# EasyEDA Pro project ProPrj_PASSMAN BLE Fingerprint V1_2025-09-09.epro

# Schematic BLE Fingerprint PM

## Sheets
1 ESP32 Mini: Board Name: Board1; Create Date: 2025-07-29; Page Name: ESP32 Mini; Project Name: PASSMAN BLE Fingerprint V1; Schematic Name: BLE Fingerprint PM; Update Date: 2025-08-02; Company: EasyEDA.com; Drawn: Luca Pazzini; Page Size: A4; Reviewed: Tolentino; Version: V1.0
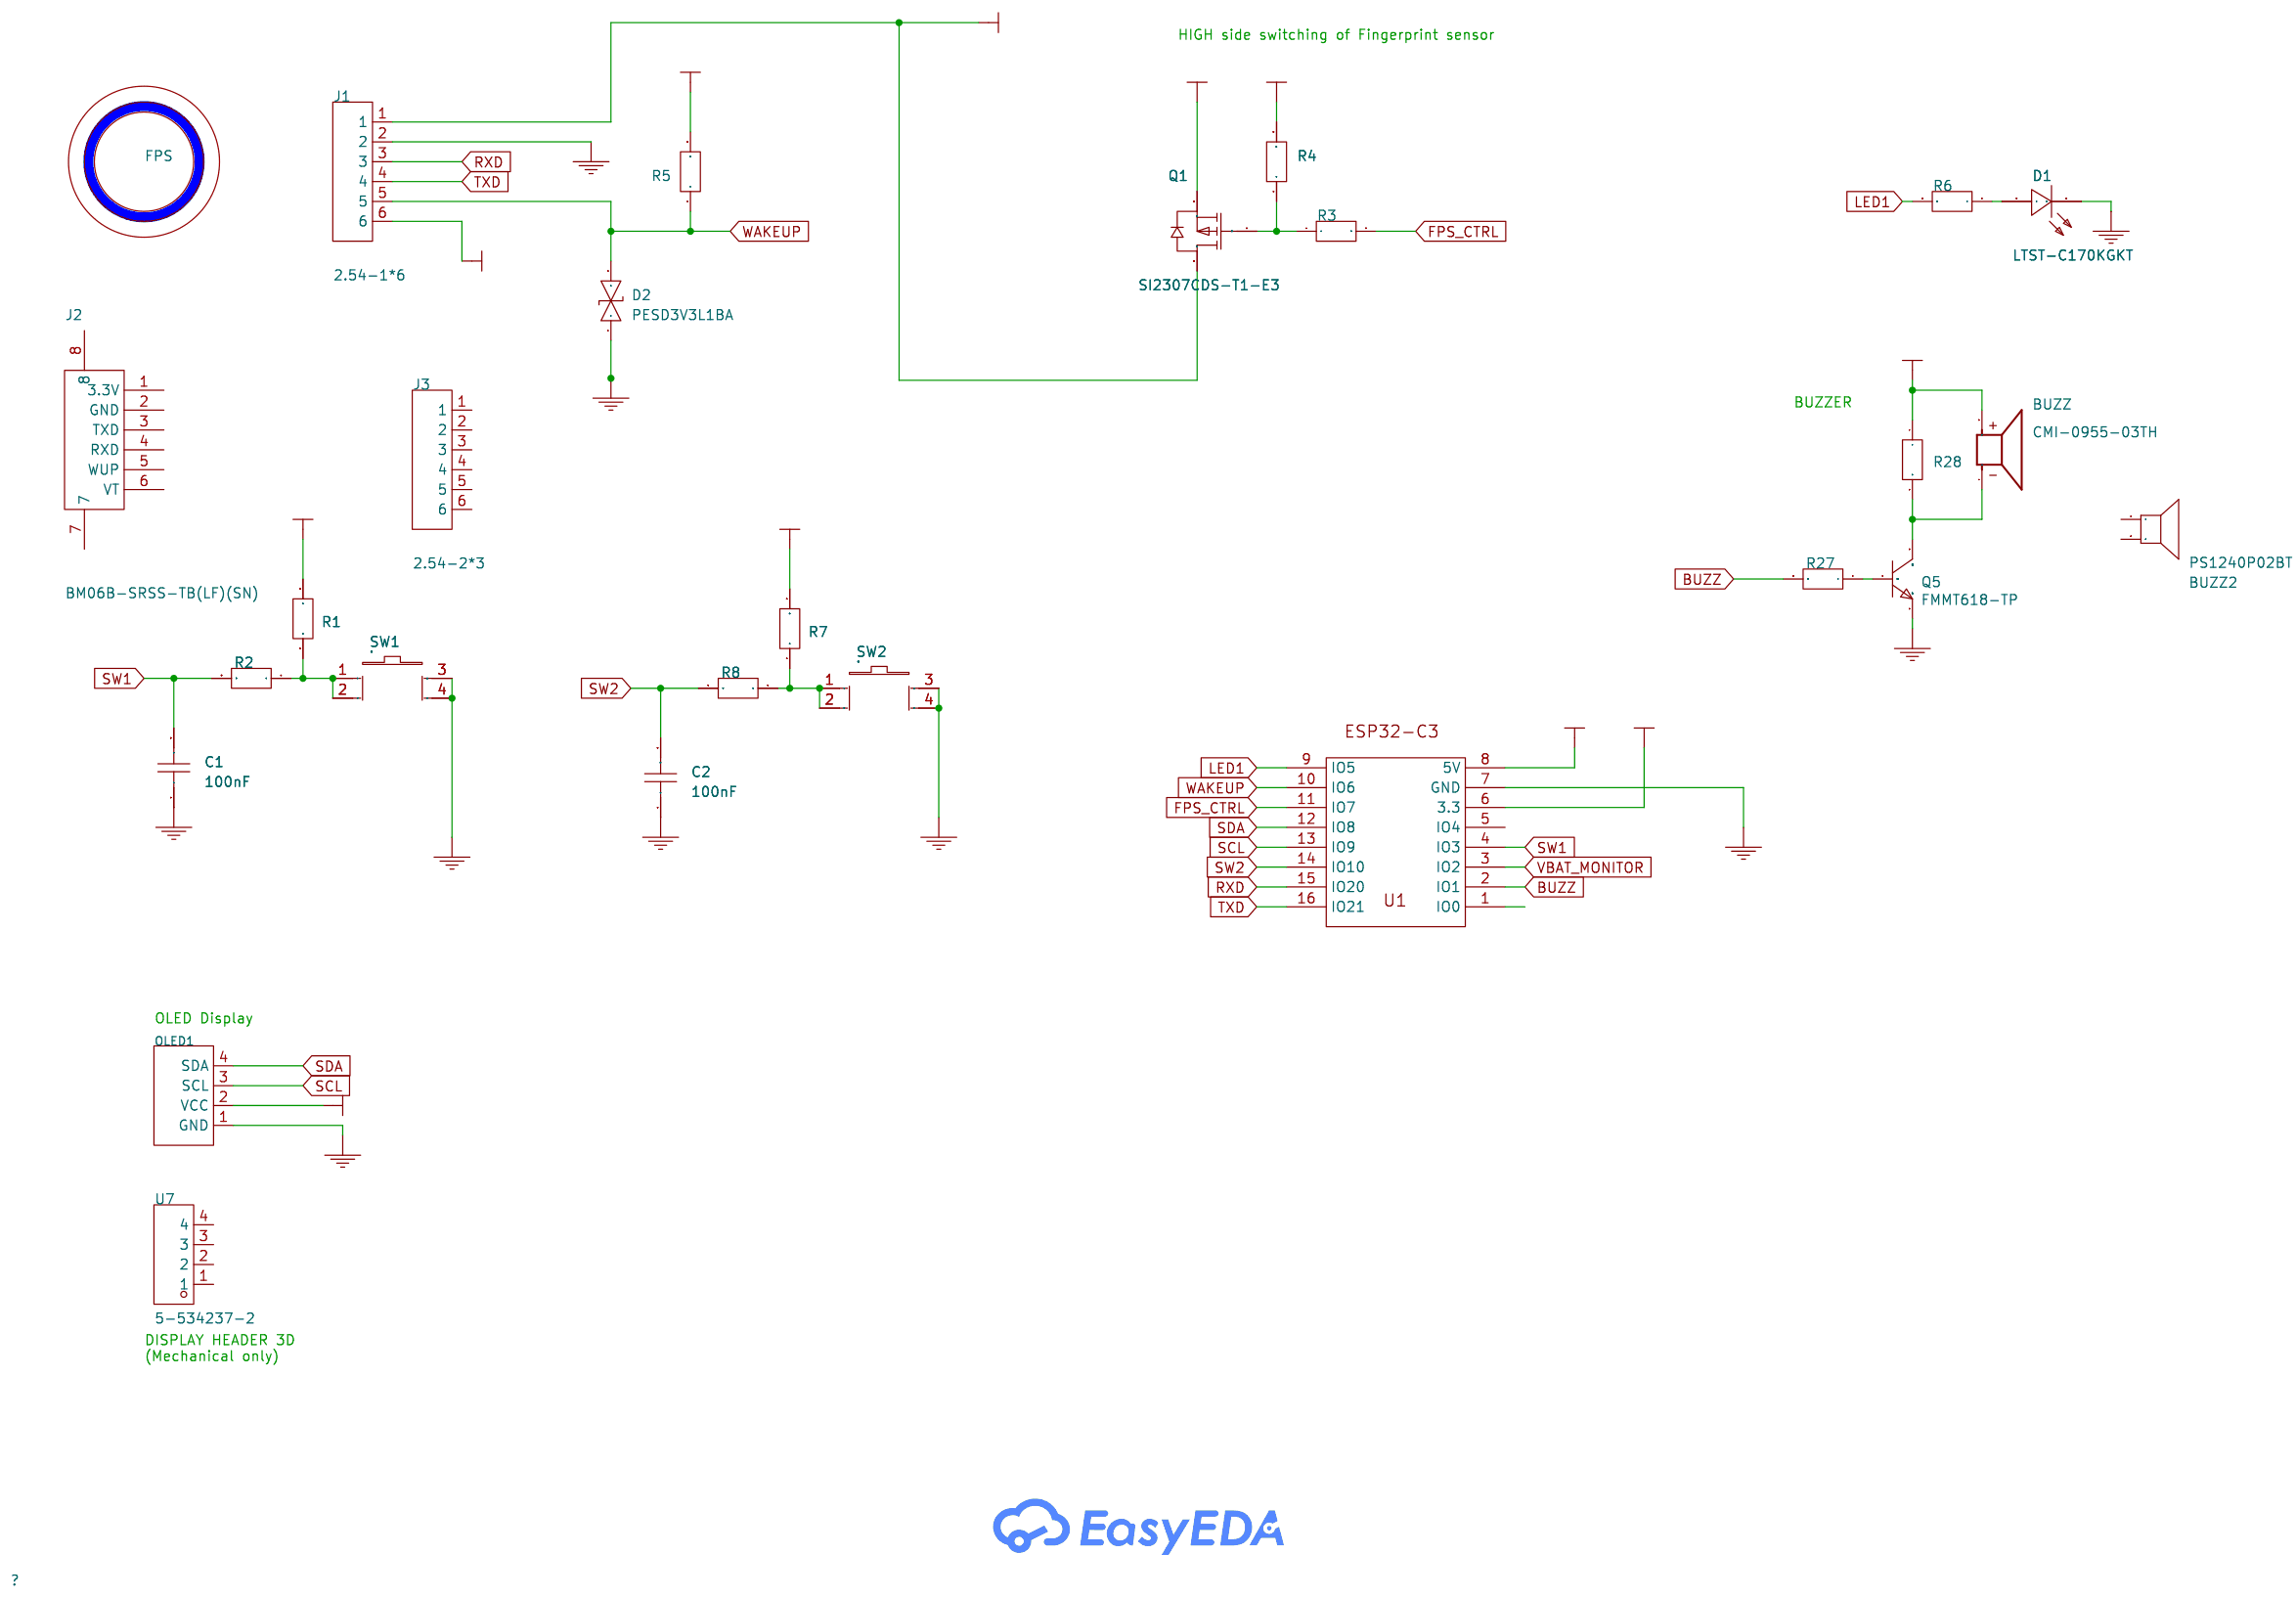
[diagram p0: ESP32 Mini]
2 2. Battery Man: Page Name: 2. Battery Man
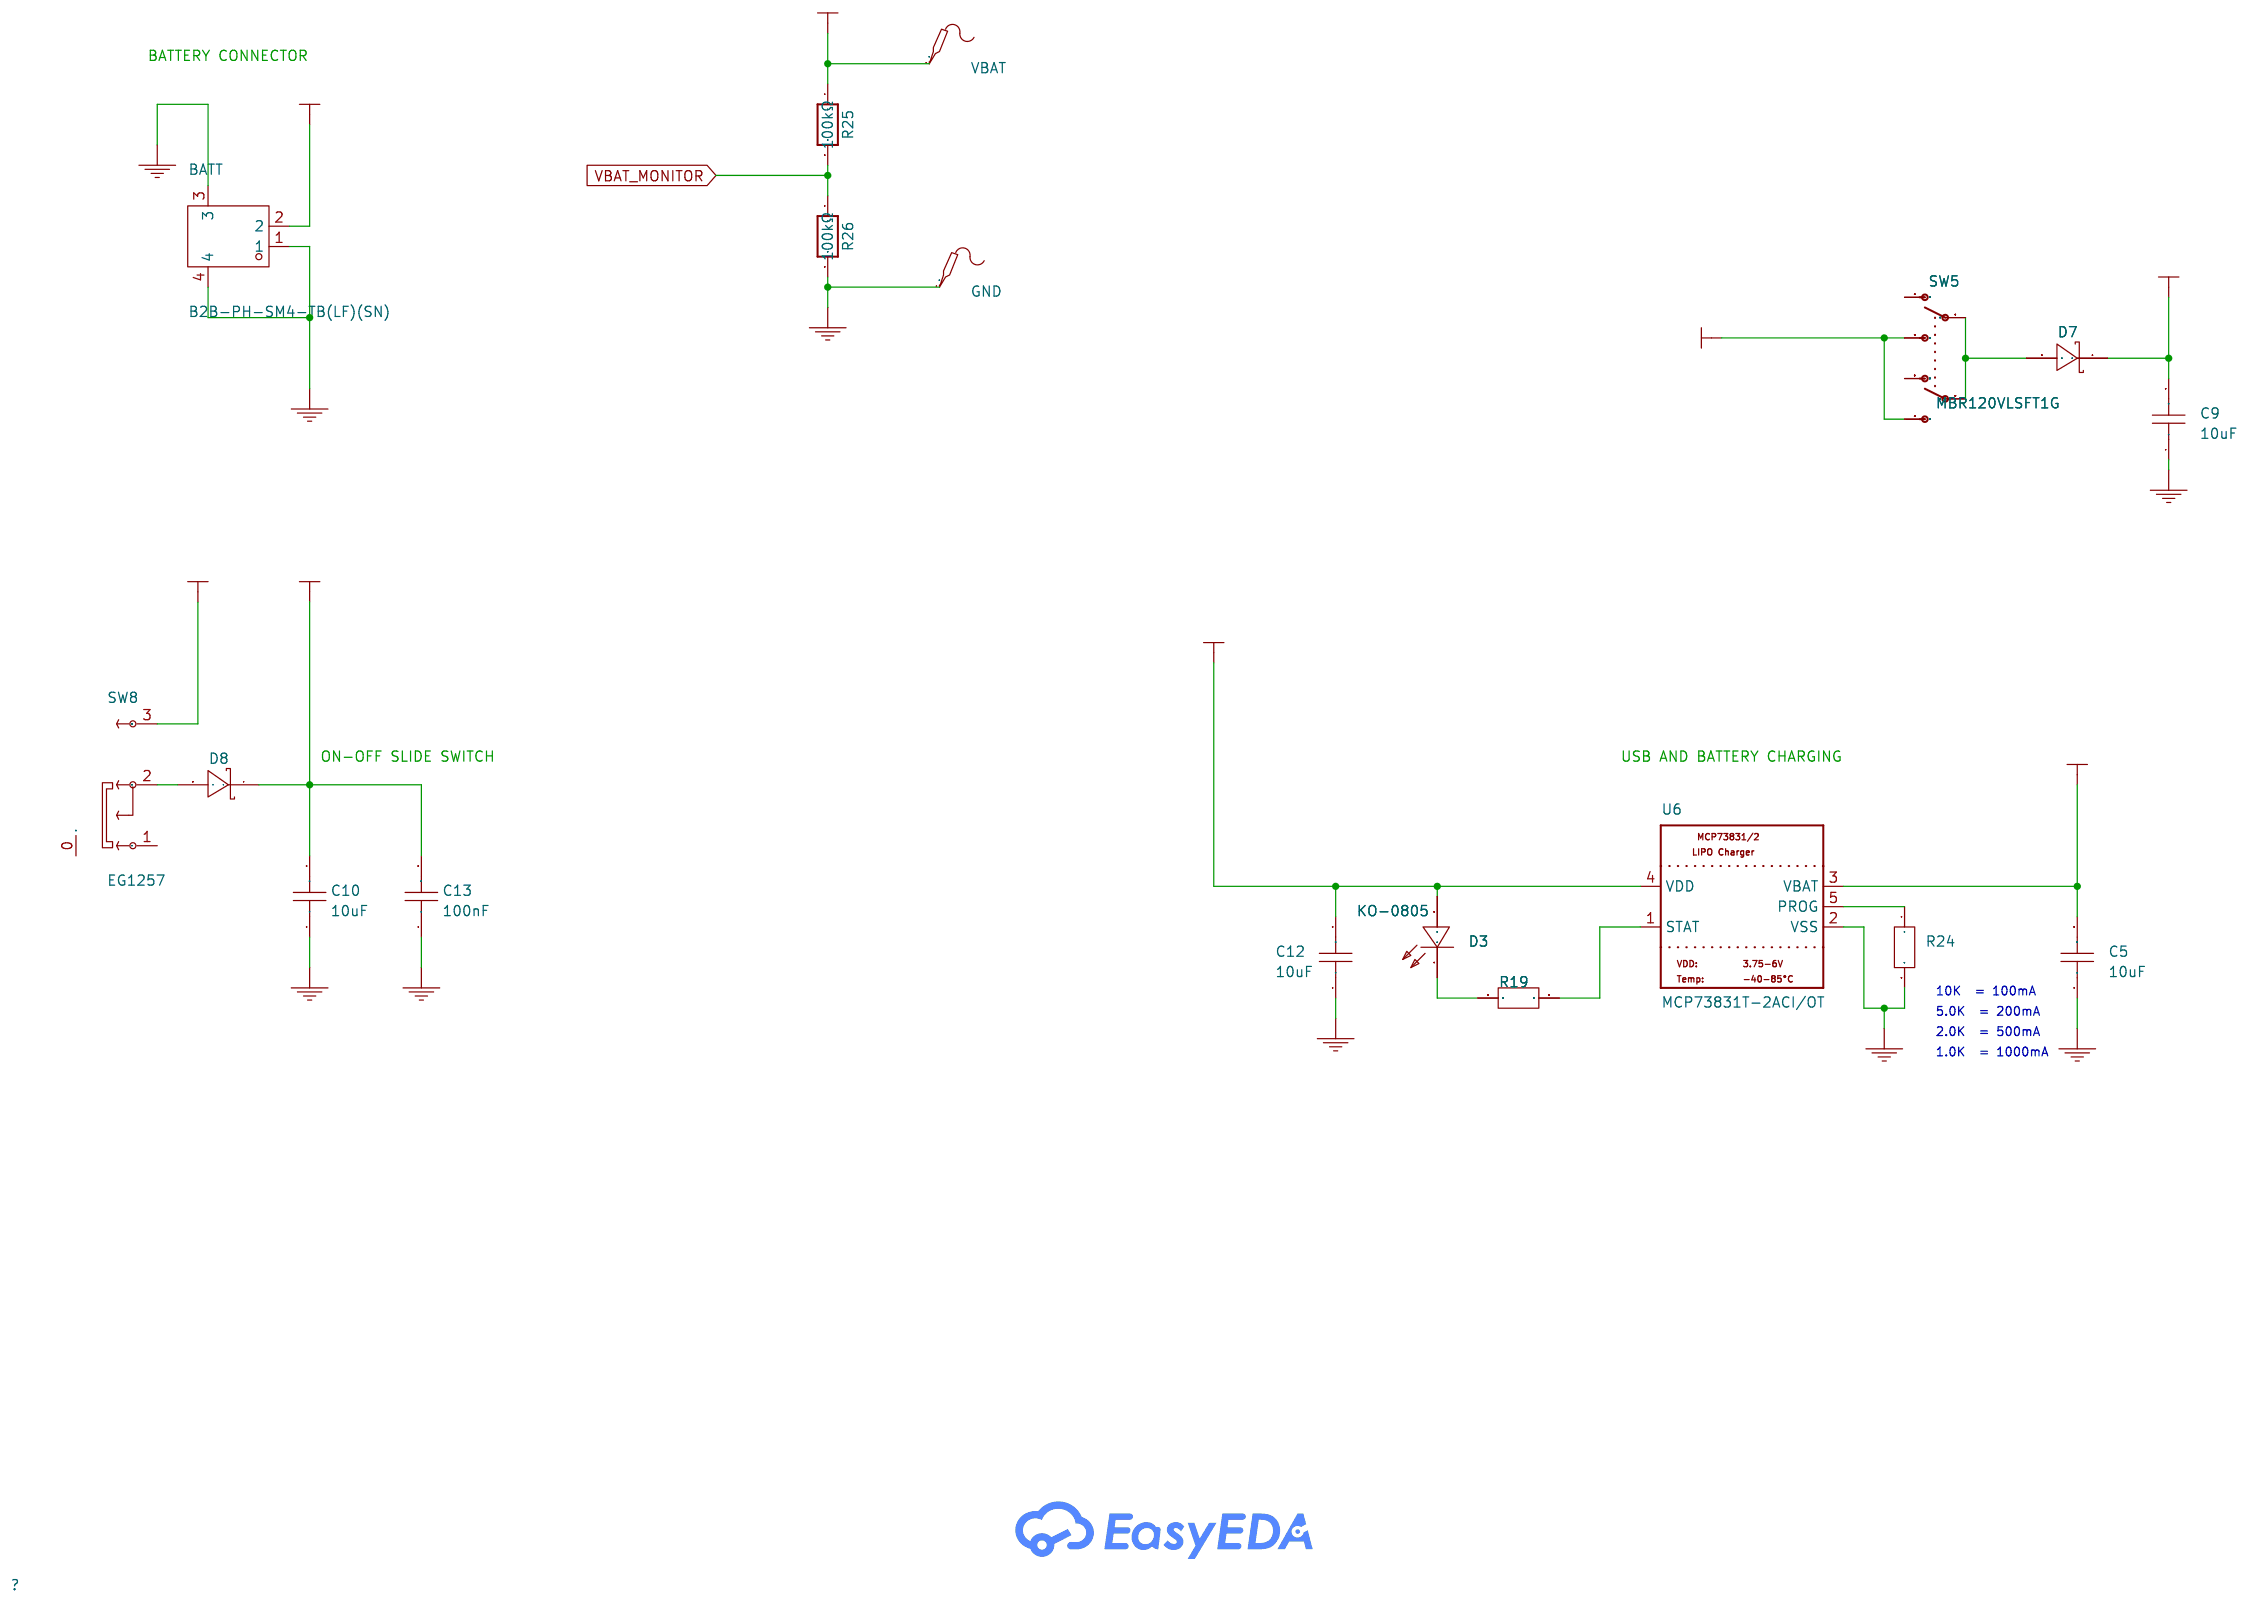
[diagram p1: 2. Battery Man]

## Parts
sheet 2. Battery Man
BATT  B2B-PH-SM4-TB(LF)(SN)  [CONN-SMD_B2B-PH-SM4-TB-LF-SN]
C5  10uF  [C0805]
C9  10uF  [C0805]
C10  10uF  [C0805]
C12  10uF  [C0805]
C13  100nF  [C0805]
D3  KO-0805  [LED0805-RD]
D7  MBR120VLSFT1G  [SOD-123F_L2.8-W1.8-LS3.7-RD]
D8  MBR120VLSFT1G  [SOD-123F_L2.8-W1.8-LS3.7-RD]
GND  -  [Test-Point-0.5mm]
R19  5.1kΩ  [R0805_NEW]
R24  5.1kΩ  [R0805_NEW]
R25  100kΩ  [R0805_NEW]
R26  100kΩ  [R0805_NEW]
SW5  SWITCH_DPDTEG1390
SW8  EG1257  [SW-SMD_EG1257]
U6  MCP73831T-2ACI/OT  [SOT-23-5_L3.0-W1.7-P0.95-LS2.8-BL]
VBAT  -  [Test-Point-0.5mm]
sheet ESP32 Mini
BUZZ  CMI-0955-03TH  [SPKR_CMI-0955-03TH]
BUZZ2  PS1240P02BT  [BUZ-TH_BD12.5-P5.00-D0.9]
C1  100nF  [C0805]
C2  100nF  [C0805]
D1  LTST-C170KGKT  [LED0805-R-RD]
D2  PESD3V3L1BA  [SOD-323_L1.8-W1.3-LS2.5-BI]
FPS1  FPS  [Fingerprint Sensor 503]
J1  2.54-1*6  [HDR-TH_6P-P2.54-V-M]
J2  BM06B-SRSS-TB(LF)(SN)  [CONN-SMD-6P-P1.00_BM06B-SRSS-TB-LF-SN]
J3  2.54-2*3  [HDR-TH_6P-P2.54-V-R2-C3-S2.54_A2541WV-2X3P]
OLED1  HS91L02W2C01  [OLED-TH_L38.0-W12.0_HS91L02W2C01]
Q1  SI2307CDS-T1-E3  [SOT-23_L2.9-W1.3-P1.90-LS2.4-BR]
Q5  FMMT618-TP  [SOT-23-3_L2.9-W1.3-P0.95-LS2.4-BR]
R1  10K  [R0805_NEW]
R2  2K  [R0805_NEW]
R3  10K  [R0805_NEW]
R4  10K  [R0805_NEW]
R5  10K  [R0805_NEW]
R6  470Ω  [R0805_NEW]
R7  10K  [R0805_NEW]
R8  2K  [R0805_NEW]
R27  2K  [R0805_NEW]
R28  2K  [R0805_NEW]
SW1  .  [KEY-TH_4P-L6.0-W6.0-P4.50]
SW2  .  [KEY-TH_4P-L6.0-W6.0-P4.50]
U1  ESP32-C3  [ESP32-C3 SUPERMINI TIPO C]
U7  5-534237-2  [HDR-TH_8P-P2.54-V-F_5-534237-2]

## Library data of the parts
BATT = B2B-PH-SM4-TB(LF)(SN): Pins Structure:1x2P Pitch:2mm Mounting Style:Brick nogging Reference Series:PH Number of Pins:2P Number of Rows:1 Number of PINs Per Row:2 Row Spacing:- Current Rating (Max):2A Contact Material:Copper Alloy Contact Plating:Tin Operating Temperature Range:; LCSC Part Name: 1x2P 间距:2mm 立贴 系列:PH; Supplier Part: C160352; Manufacturer: JST; Supplier Footprint: SMD,P=2mm; JLCPCB Part Class: Extended Part; Datasheet: https://atta.szlcsc.com/upload/public/pdf/source/20181010/C265101_22107ACC4D8714694FDA2DD97145FA81.pdf; Supplier: LCSC; Pins Structure: 1x2P; Pitch: 2mm; Mounting Style: Brick nogging; Reference Series: PH; Number of Pins: 2P; Number of Rows: 1; Number of PINs Per Row: 2; Current Rating (Max): 2A; Contact Material: Copper Alloy; Contact Plating: Tin; Operating Temperature Range: -25℃~+85℃; Rated Voltage (Max): 100V; Plastic Material: PA; Flame Retardant Rating: UL94V-0; Supplementary Features: 辅助焊脚; Colour: 米色; Z-Height of the Board: 6.6mm; X-Length of Bottom Edge on Board (Spacing Line): 7.95mm; Y-Width of Bottom Edge on Board: 7mm
C5 C9 C10 C12 = 100nF: Supplier: LCSC; Supplier Part: C3909697; Manufacturer: KEMET; Manufacturer Part: C0805X106K9RACTUC0805X106K9RACTU; Contributor: lcsc; nameAlias: Value; spicePre: C; spiceSymbolName: C2012X7R2A104M125AE
C1 C2 C13 = 100nF: Supplier: LCSC; Supplier Part: C3909697; Manufacturer: TDK; Manufacturer Part: C2012X7R2A104M125AE; Contributor: lcsc; nameAlias: Value; spicePre: C; spiceSymbolName: C2012X7R2A104M125AE
D3 = KO-0805_C9900066565: Supplier Part: C9900066565; Supplier Footprint: LED0805-光敏接收管; JLCPCB Part Class: Extended Part; Supplier: LCSC
D7 D8 = MBR120VLSFT1G: Forward Voltage (Vf@If):300mV@1A Reverse Voltage (Vr):20V Average Rectified Current (Io):1A Reverse Leakage Current (Ir):600uA@20V; LCSC Part Name: 电压:20V 电流:1A; Supplier Part: C223608; Manufacturer: onsemi(安森美); Supplier Footprint: SOD-123FL; JLCPCB Part Class: Extended Part; Datasheet: https://atta.szlcsc.com/upload/public/pdf/source/20221020/29D26ECD33A75D76A8E47ED9553F3BCF.pdf; Supplier: LCSC; Forward Voltage (Vf@If): 300mV@1A; Reverse Voltage (Vr): 20V; Average Rectified Current (Io): 1A; Reverse Leakage Current (Ir): 600uA@20V
GND VBAT = Test-Point: Test Point 测试点
R19 R24 = 0805W8F5101T5E: Type:Thick Film Resistors Resistance:5.1kΩ Tolerance:±1% Tolerance:±1% Power(Watts): Overload Voltage (Max): Temperature Coefficient:±100ppm/℃ Temperature Coefficient:±100ppm/℃ Operating Temperature Range:-55℃~+155℃ Operating Temperature Range:-55℃~+155℃; LCSC Part Name: 5.1kΩ ±1% 125mW 厚膜电阻; Supplier Part: C27834; Manufacturer: UNI-ROYAL(厚声); Supplier Footprint: 0805; JLCPCB Part Class: Basic Part; Datasheet: https://atta.szlcsc.com/upload/public/pdf/source/20200306/C422600_1E6D84923E4A46A82E41ADD87F860B5C.pdf; Supplier: LCSC; Type: Thick Film Resistors; Tolerance: ±1%; Temperature Coefficient: ±100ppm/℃; Operating Temperature Range: -55℃~+155℃
R25 R26 = RC0805FR-07100KL: Type:Thick Film Resistors Resistance: Tolerance:±1% Tolerance:±1% Power(Watts): Overload Voltage (Max): Temperature Coefficient:±100ppm/℃ Temperature Coefficient:±100ppm/℃ Operating Temperature Range:-55℃~+155℃ Operating Temperature Range:-55℃~+155℃; LCSC Part Name: 厚膜电阻 100kΩ ±1% 125mW; Supplier Part: C96346; Manufacturer: YAGEO(国巨); Supplier Footprint: 0805; JLCPCB Part Class: Extended Part; Datasheet: https://atta.szlcsc.com/upload/public/pdf/source/20170708/1499509500945.pdf; Supplier: LCSC; Type: Thick Film Resistors; Tolerance: ±1%; Temperature Coefficient: ±100ppm/℃; Operating Temperature Range: -55℃~+155℃
SW5 = adafruit_electromech_SWITCH_DPDT_EG1390
SW8 = EG1257: Circuit:Single Pole Double Throw (SPDT) Actuator Style:Rectangular column Pin Style:Gullwing Mounting Style:Standing paste Voltage Rating (DC):4V Operating Temperature:-20℃~+70℃ Operating Temperature:-20℃~+70℃; Supplier Part: C6843764; Manufacturer: E-Switch; JLCPCB Part Class: Extended Part; Supplier: LCSC; Circuit: Single Pole Double Throw (SPDT); Actuator Style: Rectangular column; Pin Style: Gullwing; Mounting Style: Standing paste; Voltage Rating (DC): 4V; Operating Temperature: -20℃~+70℃
U6 = microbuilder_MCP73831/2_
BUZZ = CMI-0955-03TH
BUZZ2 = PS1240P02BT: Supplier: LCSC; Manufacturer: TDK; Supplier Part: C76871; JLCPCB Part Class: Extended Part; nameAlias: Value; spicePre: B
D1 = LTST-C170KGKT: Emitted Color:Yellow Green Forward Voltage (VF):2V Forward Voltage (VF):2V Power Dissipation:75mW Forward Current:20mA Dominant Wavelength:571nm Dominant Wavelength:571nm Peak Wavelength:574nm Diode Configuration:- Lens Color:Colorless Transparent Lens Co; LCSC Part Name: 普绿/黄绿; Supplier Part: C98221; Manufacturer: LITEON(光宝); Supplier Footprint: 0805; JLCPCB Part Class: Extended Part; Datasheet: https://atta.szlcsc.com/upload/public/pdf/source/20180129/C98221_15171889648161316610.pdf; Supplier: LCSC; Emitted Color: Yellow Green; Forward Voltage (VF): 2V; Power Dissipation: 75mW; Forward Current: 20mA; Dominant Wavelength: 571nm; Peak Wavelength: 574nm; Lens Color: Colorless Transparent Lens; Luminous Intensity: 35mcd; Viewing Angle: 130°; Operating Temperature: -55℃~+85℃
D2 = PESD3V3L1BA_C5261082: Polarity:Bidirectional Reverse Stand-Off Voltage (Vrwm):3.3V Clamping Voltage:12V Peak Pulse Current (Ipp):38A Voltage - Breakdown:5.6V Number of Channels:Single channel Type:ESD; LCSC Part Name: 1路双向ESD 3/倒3; Supplier Part: C5261082; Manufacturer: HXY MOSFET(华轩阳电子); Supplier Footprint: SOD-323; JLCPCB Part Class: Extended Part; Datasheet: https://atta.szlcsc.com/upload/public/pdf/source/20221115/BC3A3025F80D2F34B6406648BE44DF33.pdf; Supplier: LCSC; Polarity: Bidirectional; Reverse Stand-Off Voltage (Vrwm): 3.3V; Clamping Voltage: 12V; Peak Pulse Current (Ipp): 38A; Voltage - Breakdown: 5.6V; Number of Channels: Single channel; Type: ESD
FPS1 = R503 Fingerprint Sensor: Fingerprint sensor
J1 = 2.54-1*6: Pin Structure:1x6P Pitch:2.54mm Number of Rows:Single Row Number of Pins:6P; Supplier Part: C5156615; Manufacturer: ZHOURI(洲日); Supplier Footprint: 插件,P=2.54mm; JLCPCB Part Class: Extended Part; Datasheet: https://atta.szlcsc.com/upload/public/pdf/source/20250227/F941FC765EF241ABFB2D5D72948A31A5.pdf; Supplier: LCSC; Pin Structure: 1x6P; Pitch: 2.54mm; Number of Rows: Single Row; Number of Pins: 6P
J2 = BM06B-SRSS-TB(LF)(SN): Pins Structure:1x6P Pitch:1mm Mounting Style:Brick nogging Reference Series:SH Number of Pins:6P Number of Rows:1 Number of PINs Per Row:6 Row Spacing:- Current Rating (Max):1A Contact Material:Copper Alloy Contact Plating:Tin Operating Temperature Range:; LCSC Part Name: 1x6P 间距:1mm 立贴 系列:SH; Supplier Part: C160392; Manufacturer: JST; Supplier Footprint: SMD,P=1mm; JLCPCB Part Class: Extended Part; Datasheet: https://atta.szlcsc.com/upload/public/pdf/source/20181008/C268118_5C0FE2784716D1E5DD0A36233D1E1F34.pdf; Supplier: LCSC; Pins Structure: 1x6P; Pitch: 1mm; Mounting Style: Brick nogging; Reference Series: SH; Number of Pins: 6P; Number of Rows: 1; Number of PINs Per Row: 6; Current Rating (Max): 1A; Contact Material: Copper Alloy; Contact Plating: Tin; Operating Temperature Range: -25℃~+85℃; Rated Voltage (Max): 50V; Plastic Material: PA; Flame Retardant Rating: UL94V-0; Supplementary Features: 辅助焊脚; Colour: White; Z-Height of the Board: 4.25mm; X-Length of Bottom Edge on Board (Spacing Line): 8mm; Y-Width of Bottom Edge on Board: 3.6mm
J3 = 2.54-2*3: Pin Structure:2x3P Pitch:2.54mm Number of Rows:Double Row Number of Pins:6P; Supplier Part: C5116479; Manufacturer: ZHOURI(洲日); Supplier Footprint: 插件,P=2.54mm; JLCPCB Part Class: Extended Part; Datasheet: https://atta.szlcsc.com/upload/public/pdf/source/20220729/7A96040568D3A9F25ED0F1D4F891C529.pdf; Supplier: LCSC; Pin Structure: 2x3P; Pitch: 2.54mm; Number of Rows: Double Row; Number of Pins: 6P
OLED1 = HS91L02W2C01: Main Control Chip:SSD1306 Interface Type:I2C Size:0.91 Pixel Resolution:128x32 Operating Temperature:-40℃~+70℃ Operating Temperature:-40℃~+70℃; Supplier: LCSC; Supplier Part: C5248081; Manufacturer: HS(汉昇); JLCPCB Part Class: Extended Part; LCSC Part Name: 0.91寸OLED显示屏白光IIC; Datasheet: https://atta.szlcsc.com/upload/public/pdf/source/20230727/C3E43C8E3DDA847F5681FEE7D95C153D.pdf; Main Control Chip: SSD1306; Interface Type: I2C; Size: 0.91; Pixel Resolution: 128x32; Operating Temperature: -40℃~+70℃
Q1 = SI2307CDS-T1-E3: Type:1 Piece P-Channel Drain Source Voltage (Vdss): Continuous Drain Current (Id): Drain Source On Resistance (RDS(on)@Vgs,Id):0.088Ω@10V,3.5A Power Dissipation (Pd): Gate Threshold Voltage (Vgs(th)@Id): Total Gate Charge (Qg@Vgs):4.1nC@4.5V Input Capacit; LCSC Part Name: 1个P沟道 耐压:30V 电流:2.7A; Supplier Part: C142538; Manufacturer: VISHAY; Supplier Footprint: SOT-23; JLCPCB Part Class: Extended Part; Datasheet: https://atta.szlcsc.com/upload/public/pdf/source/20171128/C142538_15118626095471147103.pdf; Supplier: LCSC; Type: 1 Piece P-Channel; Drain Source On Resistance (RDS(on)@Vgs,Id): 0.088Ω@10V,3.5A; Total Gate Charge (Qg@Vgs): 4.1nC@4.5V; Input Capacitance (Ciss@Vds): 340pF; Reverse Transfer Capacitance (Crss@Vds): 51pF; Operating Temperature: -55℃~+150℃
Q5 = FMMT618-TP: Supplier: LCSC; Supplier Part: C2975568; Manufacturer: MCC(美微科); JLCPCB Part Class: Extended Part; Contributor: LCSC; spicePre: Q
R1-R5 R7 R8 R27 R28 = RES 0805: JLCPCB Part Class: Extended Part; Contributor: LCSC; nameAlias: Value; spicePre: R; spiceSymbolName: RCT0610KJLF
R6 = RC0805FR-07470RL: Type:Thick Film Resistors Resistance: Tolerance:±1% Tolerance:±1% Power(Watts): Overload Voltage (Max): Temperature Coefficient:±100ppm/℃ Temperature Coefficient:±100ppm/℃ Operating Temperature Range:-55℃~+155℃ Operating Temperature Range:-55℃~+155℃; LCSC Part Name: 厚膜电阻 470Ω ±1% 125mW; Supplier Part: C114564; Manufacturer: YAGEO(国巨); Supplier Footprint: 0805; JLCPCB Part Class: Extended Part; Datasheet: https://atta.szlcsc.com/upload/public/pdf/source/20180821/C275644_0D56F95EFF785E7D9A1FEF436B37DA78.pdf; Supplier: LCSC; Type: Thick Film Resistors; Tolerance: ±1%; Temperature Coefficient: ±100ppm/℃; Operating Temperature Range: -55℃~+155℃
SW1 SW2 = .: Supplier Part: C59980; Supplier: LCSC; Manufacturer: ReliaPro; Manufacturer Part: button6*6*8.5; JLCPCB Part Class: Extended Part; spicePre: K; spiceSymbolName: button6*6*8.5
U1 = ESP32-C3: Contributor: atim.ipn.cet; spicePre: U; spiceSymbolName: ESP32-C3 SuperMini Tipo C; Package Display: No
U7 = 5-534237-2: Pitch:2.54mm Mounting Type:Through Hole Number of Rows:1 Number of Positions:4P Current Rating:2A Insulation Height:8.64mm Contact Plating:Tin Operating Temperature:-65℃~+125℃ Operating Temperature:-65℃~+125℃; LCSC Part Name: 间距:2.54mm 直插; Supplier Part: C5165471; Manufacturer: TE Connectivity(泰科电子); Supplier Footprint: 插件,P=2.54mm; Datasheet: https://atta.szlcsc.com/upload/public/pdf/source/20231023/ENG_CD_534237_S.pdf-87c0b3f817e334f17197daf8e8057363.pdf; Supplier: LCSC; Pitch: 2.54mm; Mounting Type: Through Hole; Number of Rows: 1; Number of Positions: 4P; Current Rating: 2A; Insulation Height: 8.64mm; Contact Plating: Tin; Operating Temperature: -65℃~+125℃

## Nets
3.3V: J1.6 OLED1.2(VCC) Q1.2(S) R1.2 R4.2 R5.2 R7.2 U1.6(3.3)
5V: C9.2 D7.1(K)
GND: BATT.1 BATT.3 BATT.4 C1.1 C2.1 C5.1 C9.1 C10.1 C12.1 C13.1 D1.1(K) D2.1 GND.1 J1.2 OLED1.1(GND) Q5.2(EMITTER) R24.2 R26.2 SW1.3 SW1.4 SW2.3 SW2.4 U1.7(GND) U6.2(VSS)
VBAT: BATT.2 C5.2 SW5.S1 SW5.S2 SW8.3 U6.3(VBAT)
VBAT_MONITOR: R25.2 R26.1 U1.3(IO2)
VCC_FPS: J1.1 Q1.3(D)
BUZZ: R27.2 U1.2(IO1)
FPS_CTRL: R3.2 U1.11(IO7)
LED1: R6.2 U1.9(IO5)
RXD: J1.3 U1.15(IO20)
SCL: OLED1.3(SCL) U1.13(IO9)
SDA: OLED1.4(SDA) U1.12(IO8)
SW1: C1.2 R2.2 U1.4(IO3)
SW2: C2.2 R8.2 U1.14(IO10)
TXD: J1.4 U1.16(IO21)
V_PIN8_ESP32: BUZZ.P C10.2 C12.2 C13.2 D3.2(A) D8.1(K) R25.1 R28.1 U1.8(5V) U6.4(VDD) VBAT.1
WAKEUP: D2.2 J1.5 R5.1 U1.10(IO6)
$1N1363: R1.1 R2.1 SW1.1 SW1.2
$1N3358: Q1.1(G) R3.1 R4.1
$1N4686: D1.2(A) R6.1
$1N4912: R7.1 R8.1 SW2.1 SW2.2
$1N10626: BUZZ.N Q5.3(COLLECTOR) R28.2
$1N10766: Q5.1(BASE) R27.1
$3N553: D3.1(K) R19.2
$3N555: R19.1 U6.1(STAT)
$3N557: R24.1 U6.5(PROG)
$3N5305: D8.2(A) SW8.2
Net-(D7-2): D7.2(A) SW5.P1 SW5.P2

Not connected (* = marked no-connect by the designer): BUZZ2 1 2; J2 1(3.3V) 2(GND) 3(TXD) 4(RXD) 5(WUP) 6(VT) 7 8; J3 1 2 3 4 5 6; SW5 O1 O2; SW8 0(EH) 1; U1 1(IO0) 5(IO4); U7 1 2 3 4

## Notes on the sheets
sheet 1
- HIGH side switching of Fingerprint sensor
- BUZZER
- OLED Display
- DISPLAY HEADER 3D
  (Mechanical only)
sheet 2
- BATTERY CONNECTOR
- ON-OFF SLIDE SWITCH
- USB AND BATTERY CHARGING
- 10K  = 100mA
- 5.0K  = 200mA
- 2.0K  = 500mA
- 1.0K  = 1000mA

# Board PCB ESP32 PassMan
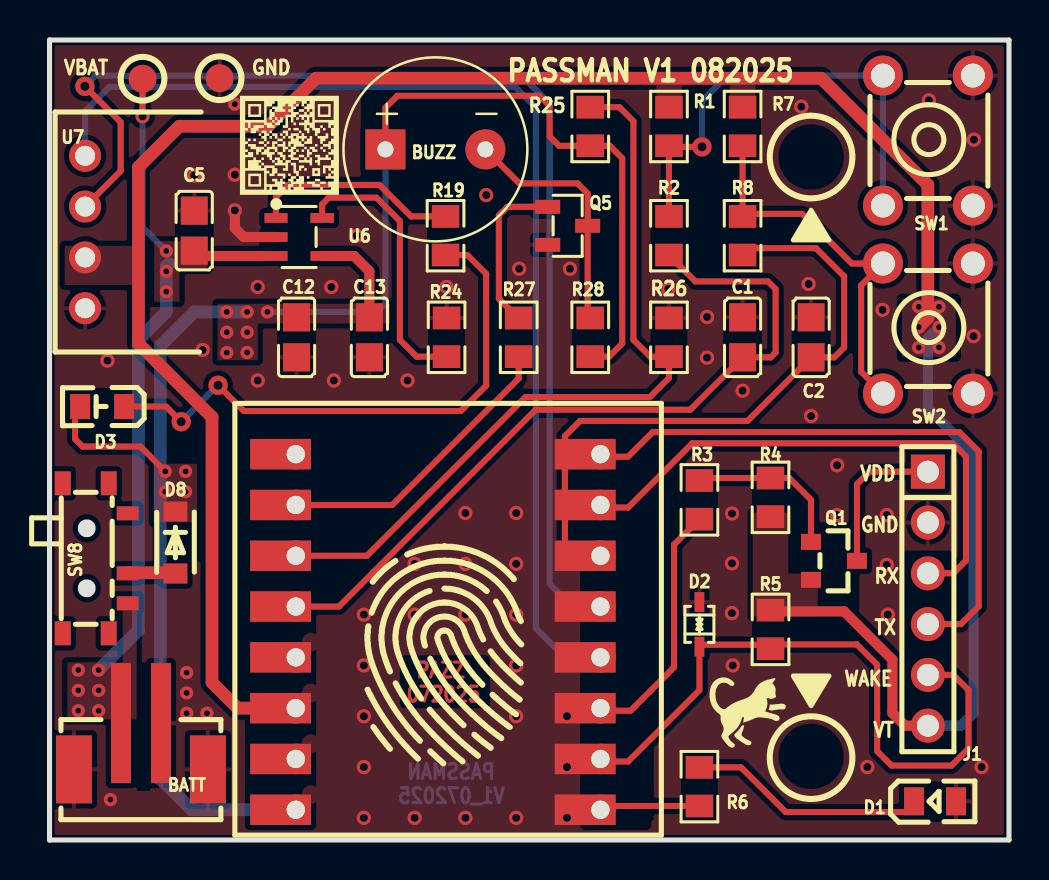
[diagram p2: board, top side]
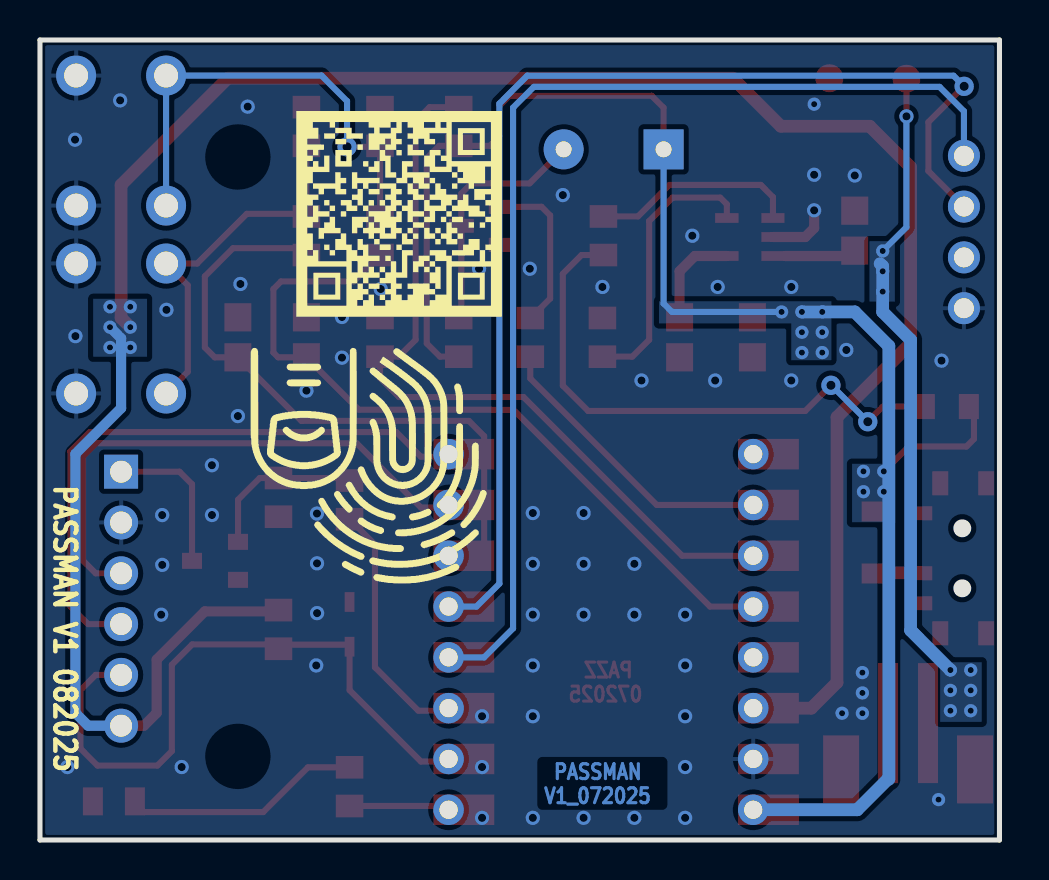
[diagram p3: board, bottom side, seen from below]

Outline 48 x 40 mm; copper layers: Top Layer, Bottom Layer. Coordinates in mm from the lower left corner of the outline.
Outline path: 0,40 0,0 48,0 48,40 0,40
Stack: Top Layer 0.035mm / Dielectric1 1.51mm FR4 er 4.5 / Bottom Layer 0.035mm

## Design rules (mm)
template: Custom Config
spacing copperThickness1oz (default): track to track 0.254, other pairs 0.203 to 0.406
spacing copperThickness2oz: track to track 0.203, other pairs 0.152 to 0.3
track width copperThickness1oz (default): min 0.127, default 0.305, max 2.54
track width copperThickness2oz: min 0.203, default 0.254, max 2.54
differential pair differentialPair (default): width min 0.127, default 0.254, max 2.54; gap min 0.152, default 0.152
via viaSize (default): diameter min 0.5, default 0.965, max 10; hole min 0.3, default 0.406, max 6.299

## Placement (name value [footprint] x y rotation side)
BATT  B2B-PH-SM4-TB(LF)(SN)  [CONN-SMD_B2B-PH-SM4-TB-LF-SN]  4.57 4.69 0 top
BUZZ  CMI-0955-03TH  [SPKR_CMI-0955-03TH]  19.3 34.53 0 top
C1  100nF  [C0805]  34.67 25.13 270 top
C2  100nF  [C0805]  38.1 25.13 270 top
C5  10uF  [C0805]  7.24 30.47 270 top
C12  10uF  [C0805]  12.36 25.13 90 top
C13  100nF  [C0805]  16 25.13 90 top
D1  LTST-C170KGKT  [LED0805-R-RD]  44.3 1.93 0 top
D2  PESD3V3L1BA  [SOD-323_L1.8-W1.3-LS2.5-BI]  32.51 10.78 270 top
D3  KO-0805  [LED0805-RD]  2.63 21.67 180 top
D8  MBR120VLSFT1G  [SOD-123F_L2.8-W1.8-LS3.7-RD]  6.3 14.88 270 top
FPS1  FPS  [Fingerprint Sensor 503]  19.68 12.11 0 top
GND  -  [Test-Point-0.5mm]  8.51 38.09 90 top
J1  2.54-1*6  [HDR-TH_6P-P2.54-V-M]  43.94 12.06 270 top
OLED1  HS91L02W2C01  [OLED-TH_L38.0-W12.0_HS91L02W2C01]  1.78 30.4 0 top
Q1  SI2307CDS-T1-E3  [SOT-23_L2.9-W1.3-P1.90-LS2.4-BR]  39.24 13.96 180 top
Q5  FMMT618-TP  [SOT-23-3_L2.9-W1.3-P0.95-LS2.4-BR]  25.92 30.71 180 top
R1  10K  [R0805_NEW]  30.99 35.67 90 top
R2  2K  [R0805_NEW]  30.99 30.21 270 top
R3  10K  [R0805_NEW]  32.51 17.01 270 top
R4  10K  [R0805_NEW]  36.07 17.13 270 top
R5  10K  [R0805_NEW]  36.07 10.53 90 top
R6  470Ω  [R0805_NEW]  32.51 2.67 270 top
R7  10K  [R0805_NEW]  34.67 35.67 90 top
R8  2K  [R0805_NEW]  34.67 30.21 270 top
R19  5.1kΩ  [R0805_NEW]  19.81 30.21 270 top
R24  5.1kΩ  [R0805_NEW]  19.86 25.13 90 top
R25  100kΩ  [R0805_NEW]  27.05 35.67 90 top
R26  100kΩ  [R0805_NEW]  30.99 25.13 90 top
R27  2K  [R0805_NEW]  23.47 25.13 270 top
R28  2K  [R0805_NEW]  27.05 25.13 90 top
SW1  .  [KEY-TH_4P-L6.0-W6.0-P4.50]  43.94 34.97 270 top
SW2  .  [KEY-TH_4P-L6.0-W6.0-P4.50]  43.94 25.57 270 top
SW8  EG1257  [SW-SMD_EG1257]  2.29 14.08 270 top
U1  ESP32-C3  [ESP32-C3 SUPERMINI TIPO C]  19.94 10.4 0 top
U6  MCP73831T-2ACI/OT  [SOT-23-5_L3.0-W1.7-P0.95-LS2.8-BL]  12.49 30.15 270 top
U7  5-534237-2  [HDR-TH_8P-P2.54-V-F_5-534237-2]  1.78 29.96 90 top
VBAT  -  [Test-Point-0.5mm]  4.65 38.06 90 top

## Footprints (pads in the part's own frame, mm; a bottom-side part is the same pattern mirrored in y, then rotated)
C0805
  rect 1.41x1.35 smd: 1(-1,0) 2(1,0)
CONN-SMD_B2B-PH-SM4-TB-LF-SN
  rect 1x6 smd: 1(1.002,1.157) 2(-0.998,1.157)
  rect 1.8x3.4 smd: 3(-3.35,-1.157) 4(3.35,-1.157)
ESP32-C3 SUPERMINI TIPO C
  custom 3.048x1.524 smd: 1(-7.62,8.89) 2(-7.62,6.35) 3(-7.62,3.81) 4(-7.62,1.27) 5(-7.62,-1.27) 6(-7.62,-3.81) 7(-7.62,-6.35) 8(-7.62,-8.89) 9(7.62,-8.89) 10(7.62,-6.35) 11(7.62,-3.81) 12(7.62,-1.27) 13(7.62,1.27) 14(7.62,3.81) 15(7.62,6.35) 16(7.62,8.89)
  round 1.524 hole 0.914: 1(-7.62,8.89) 2(-7.62,6.35) 3(-7.62,3.81) 4(-7.62,1.27) 5(-7.62,-1.27) 6(-7.62,-3.81) 7(-7.62,-6.35) 8(-7.62,-8.89) 9(7.62,-8.89) 10(7.62,-6.35) 11(7.62,-3.81) 12(7.62,-1.27) 13(7.62,1.27) 14(7.62,3.81) 15(7.62,6.35) 16(7.62,8.89)
HDR-TH_6P-P2.54-V-M
  rect 1.7x1.7 hole 1.1: 1(-6.35,0)
  round 1.7 hole 1.1: 2(-3.81,0) 3(-1.27,0) 4(1.27,0) 5(3.81,0) 6(6.35,0)
KEY-TH_4P-L6.0-W6.0-P4.50
  round 2 hole 1.2: 1(-3.25,-2.25) 2(3.25,-2.25) 3(3.25,2.25) 4(-3.25,2.25)
LED0805-R-RD
  rect 1x1.399 smd: 1(1.05,0) 2(-1.05,0)
LED0805-RD
  rect 1x1.25 smd: 1(-1.1,0) 2(1.1,0)
OLED-TH_L38.0-W12.0_HS91L02W2C01
  round 1.6 hole 1: 1(0,-3.81) 2(0,-1.27) 3(0,1.27) 4(0,3.81)
R0805_NEW
  rect 1.133x1.377 smd: 1(-0.966,0) 2(0.966,0)
SOD-123F_L2.8-W1.8-LS3.7-RD
  rect 1x1.2 smd: 1(-1.55,0) 2(1.55,0)
SOD-323_L1.8-W1.3-LS2.5-BI
  rect 0.985x0.49 smd: 1(-1.117,0) 2(1.117,0)
SOT-23-3_L2.9-W1.3-P0.95-LS2.4-BR
  rect 1.25x0.7 smd: 1(1,-0.95) 2(1,0.95) 3(-1,0)
SOT-23-5_L3.0-W1.7-P0.95-LS2.8-BL
  rect 0.49x1.157 smd: 1(-0.95,-1.153) 2(0,-1.153) 3(0.95,-1.153)
  rect 0.49x1.175 smd: 4(0.95,1.153) 5(-0.95,1.153)
SOT-23_L2.9-W1.3-P1.90-LS2.4-BR
  rect 1x0.8 smd: 1(1.15,-0.95) 2(1.15,0.95) 3(-1.15,0)
SPKR_CMI-0955-03TH
  round 2 hole 0.8: N(2.5,0)
  rect 2x2 hole 0.8: P(-2.5,0)
SW-SMD_EG1257
  rect 1.2x0.8 smd: 0(-3.75,0.675) 0(-3.75,-1.625) 0(3.75,0.675) 0(3.75,-1.625)
  rect 0.7x1.1 smd: 1(-2.25,1.625) 2(0.75,1.625) 3(2.25,1.625)
Test-Point-0.5mm
  round 1.397 smd: 1(0,0)

## Nets
As in the schematic, except:
VBAT: BATT.2 C5.2 SW8.3 U6.3 VBAT.1
V_PIN8_ESP32: BUZZ.P C12.2 C13.2 D3.2 D8.1 R25.1 R28.1 U1.8 U6.4

Pads without a net: SW8 0 1; U1 5

## Via types
v1: diameter 0.711, hole 0.406, Top Layer to Bottom Layer, 59 vias
v2: diameter 0.66, hole 0.305, Top Layer to Bottom Layer, 32 vias
v3: diameter 0.965, hole 0.457, Top Layer to Bottom Layer, 4 vias

## Routing (per net, layer and track width the routed paths; a pad name or vN(x,y) marks a point on that pad's centre or on a via; arc(x,y) is an arc through that point)
3.3V: length 117.7
  Top Layer w0.508: 36.09,11.43 39.75,11.43 42.16,9.02 42.16,6.35 42.8,5.71 J1.6
  Top Layer w0.635: v2(43.48,25.64) 43.94,26.1 43.94,32.75 38.61,38.09 13.34,38.09 10.93,35.69 6.49,35.69 4.44,33.64 4.44,24.83 8.13,21.14 8.13,7.87 9.41,6.59 U1.6
  Bottom Layer w0.508: v2(44.5,25.64) 43.94,25.09 43.94,21.59 46.23,19.3 46.23,6.35 45.59,5.71 J1.6
  vias: v2(43.48,26.66) v2(43.48,24.63) v2(44.5,26.66) v2(44.5,24.63)
GND: length 3.1
  Top Layer w0.508: U6.2 9.72,30.15 9.27,30.59 v1(9.27,31.48)
  vias: v1(2.9,23.97) v1(7.24,33.22) v1(7.66,24.5) v1(9.27,33.26) v1(10.41,27.65) v1(10.41,22.97) v1(14.1,27.65) v1(14.22,22.97) v1(15.37,30.21) v1(15.72,11.27) v1(15.72,8.73) v1(15.72,6.19) v1(15.72,3.65) v1(15.72,1.11) v1(17.91,22.97) v1(18.26,13.81) v1(18.26,11.27) v1(18.26,1.11) v1(19.86,27.65) v1(20.81,16.35) v1(20.81,13.81) v1(20.81,11.27) v1(20.81,1.11) v1(21.84,32.25) v1(23.34,16.35) v1(23.34,13.81) v1(23.34,11.27) v1(23.34,8.73) v1(23.34,6.19) v1(23.34,1.11) v1(23.5,28.56) v1(25.88,6.19) v1(25.88,3.65) v1(25.88,1.11) v1(26.03,28.56) v1(30.95,27.55) v1(32.89,26.15) v1(32.89,24.12) v1(34.14,16.32) v1(34.14,13.83) v1(34.14,11.34) v1(34.18,8.73) v1(34.67,22.47) v1(37.61,36.67) v1(37.97,27.8) v1(38.1,21.2) v1(39.4,18.74) v1(39.4,16.25) v1(40.91,3.65) v1(41.67,26.51) v1(41.89,16.25) v1(41.88,13.76) v1(41.94,11.27) v1(43.99,36.98) v1(46.25,35.02) v1(46.23,25.19) v1(46.63,3.65) v2(3.05,2.02) v2(6.86,8.37) v2(6.86,7.35) v2(6.86,6.34) v2(7.87,6.34) v2(9.27,36.79)
VBAT: length 33.9
  Top Layer w0.305: 4.65,37.55 v1(4.65,36.18)
  Top Layer w0.508: C5.2 7.51,29.2 10.69,29.2 10.7,29.2
  Bottom Layer w0.305: v1(4.65,36.18) 4.65,30.64 v2(5.84,29.45)
  Bottom Layer w0.635: v2(2.45,8.5) 4.44,10.49 4.44,25.01 5.84,26.4 v2(5.84,27.42) 5.84,28.69 5.97,28.82
  vias: v2(1.44,8.5) v2(1.44,7.48) v2(1.44,6.46) v2(2.45,7.48) v2(2.45,6.46) v2(5.84,28.44)
VBAT_MONITOR: length 38.9
  Top Layer w0.305: U1.3 15.88,14.21 23.81,22.15 30.03,22.15 30.99,23.1 R26.1 30.05,24.17 29.21,25.01 29.21,35.94 28.51,36.64 R25.2
VCC_FPS: length 7.6
  Top Layer w0.305: Q1.3 40.39,17.79 41.02,18.41 J1.1
BUZZ: length 14.8
  Top Layer w0.305: 23.47,24.15 23.47,23.08 17.15,16.75 U1.2
FPS_CTRL: length 12.5
  Top Layer w0.305: 27.56,6.46 29.07,6.46 31.24,8.64 31.24,14.77 R3.2
LED1: length 5.1
  Top Layer w0.305: 32.51,1.7 27.88,1.7 27.56,1.38
RXD: length 27.3
  Top Layer w0.305: J1.3 45.21,13.33 45.85,13.97 45.85,19.18 45.19,19.84 32.16,19.84 28.94,16.62 27.56,16.62
SCL: length 58.6
  Top Layer w0.305: OLED1.3 3.56,33.45 3.56,35.89 v3(1.77,37.68)
  Bottom Layer w0.305: v3(1.77,37.68) 2.3,38.21 23.62,38.21 25.02,36.82 25.02,12.81 26.16,11.67 U1.13
SDA: length 56
  Bottom Layer w0.305: U1.12 25.78,9.13 24.33,10.58 24.33,36.61 23.29,37.66 3,37.66 1.78,36.44 1.78,33.83
SW1: length 38.5
  Top Layer w0.305: U1.4 14.48,11.67 24.32,21.51 32.05,21.51 C1.2 36.08,24.13 36.32,24.37 36.32,27.55 35.94,27.93 32.31,27.93 R2.2
SW2: length 32.6
  Top Layer w0.305: R8.2 35.01,29.59 38.34,29.59 39.75,28.18 39.75,24.63 39.26,24.13 C2.2 34.92,20.95 26.54,20.95 25.78,20.19 25.78,14.73 26.3,14.21 U1.14
TXD: length 30.5
  Top Layer w0.305: 27.56,19.16 28.94,19.16 30.18,20.4 45.52,20.4 46.48,19.43 46.48,11.68 45.59,10.8 J1.4
V_PIN8_ESP32: length 87
  Top Layer w0.305: 1.28,21.67 1.28,20.05 1.65,19.67 4.55,19.67 v2(5.79,18.43) ; R25.1 25.49,34.71 25.02,35.18 25.02,36.7 24.51,37.21 17.4,37.21 16.8,36.62 BUZZ.P ; R25.1 28.03,34.71 28.65,34.09 28.65,24.83 27.99,24.17 R28.1 ; R25.1 26.96,34.8
  Top Layer w0.508: 16,26.26 16,28.44 15.24,29.2 13.64,29.2
  Bottom Layer w0.305: v2(10.9,26.4) 16.38,26.4 16.8,26.83 BUZZ.P
  Bottom Layer w0.635: 5.59,3.04 7.11,1.51 U1.8 ; 5.53,3.04 5.53,24.7 7.24,26.4 v2(8.87,26.4) ; v2(9.88,26.4) 8.99,26.4
  vias: v2(5.79,17.41) v2(6.8,18.43) v2(6.8,17.41) v2(8.87,25.39) v2(8.87,24.37) v2(9.88,25.39) v2(9.88,24.37)
WAKEUP: length 32.9
  Top Layer w0.305: R5.1 36.28,9.78 40.39,9.78 41.4,8.76 41.4,4.44 42.13,3.72 45.12,3.72 45.97,4.57 45.97,7.49 45.21,8.25 J1.5 ; 36.02,9.51 35.76,9.77 32.61,9.77 D2.2 32.51,7.49 28.94,3.92 27.56,3.92
$1N1363: length 23.6
  Top Layer w0.305: R2.1 R1.1 31.04,34.66 v3(32.64,34.66)
  Bottom Layer w0.305: SW1.2 SW1.1 33.92,38.22 32.64,36.94 v3(32.64,34.66)
$1N3358: length 8.2
  Top Layer w0.305: Q1.1 38.09,17.01 37.01,18.1 R4.1 32.64,18.1 R3.1
$1N4686: length 11.9
  Top Layer w0.305: D1.2 43.25,1.85 42.8,1.4 36.83,1.4 34.59,3.63 R6.1
$1N4912: length 19
  Top Layer w0.305: SW2.2 40.6,23.41 40.6,27.74 SW2.1 40.14,28.82 37.65,31.31 34.8,31.31 R8.1 R7.1
$1N10626: length 12.3
  Top Layer w0.305: R28.2 26.92,26.23 Q5.3 26.92,30.71 26.92,32.32 26.42,32.83 23.51,32.83 BUZZ.N
$1N10766: length 8.2
  Top Layer w0.305: Q5.1 22.91,31.66 22.48,31.23 22.48,27.07 23.47,26.08
$3N553: length 28.5
  Top Layer w0.305: v3(8.43,22.74) 9.72,21.45 20.57,21.45 21.84,22.72 21.84,28.31 20.91,29.25 R19.2 ; v3(6.59,20.91) 5.83,21.67 3.48,21.67
  Bottom Layer w0.305: v3(8.43,22.74) 8.41,22.74 v3(6.59,20.91)
$3N555: length 10.4
  Top Layer w0.305: U6.1 11.33,32.15 11.94,32.75 16.51,32.75 18.08,31.18 R19.1
$3N557: length 13.8
  Top Layer w0.305: 13.64,31.1 13.64,31.79 13.97,32.12 16.35,32.12 17.53,30.95 17.53,25.01 18.37,24.17 R24.1
$3N5305: length 2.4
  Top Layer w0.635: SW8.2 3.94,13.36 6.26,13.36 D8.2

## Copper pours and planes (outline as drawn; the poured copper is in the pictures)
3.3V on Top Layer: 30.35,38.09 31.62,38.09 31.62,36.31 30.35,36.31
3.3V on Top Layer: 0.76,29.71 4.7,29.71 4.7,27.75 0.76,27.75
3.3V on Top Layer: 42.64,27.06 45.34,27.06 45.34,24.17 42.64,24.17
3.3V on Top Layer: 35.18,16.37 38.43,16.37 38.43,11.18 35.18,11.18
3.3V on Top Layer: 34.03,38.09 35.31,38.09 35.31,36.31 34.03,36.31
3.3V on Bottom Layer: 42.64,27.06 45.34,27.06 45.34,24.17 42.64,24.17
GND on Top Layer: 0,40 48,40 48,0 0,0
GND on Bottom Layer: 0,40 48,40 48,0 0,0
VBAT on Top Layer: 0.89,11.85 4.36,11.85 4.36,6.03 0.89,6.03
VBAT on Top Layer: 5.23,29.94 7.91,29.94 7.91,26.91 5.23,26.91
VBAT on Bottom Layer: 0.89,8.89 2.97,8.89 2.97,5.91 0.89,5.91
VBAT on Bottom Layer: 5.23,29.94 6.5,29.94 6.5,26.92 5.23,26.92
V_PIN8_ESP32 on Top Layer: 5.22,18.81 7.38,18.81 7.38,15.89 5.22,15.89
V_PIN8_ESP32 on Top Layer: 8.41,26.81 17.03,26.81 17.03,23.99 8.41,23.99
V_PIN8_ESP32 on Bottom Layer: 8.41,26.94 17.03,26.94 17.03,23.99 8.41,23.99
V_PIN8_ESP32 on Bottom Layer: 5.22,18.81 7.38,18.81 7.38,15.89 5.22,15.89

## Text on the board
Bottom Layer: PASSMAN / V1_072025
Bottom Silkscreen Layer: PASSMAN V1 082025
Document Layer: Layer | Top Silkscreen Layer | Top Paste Mask Layer | Top Solder Mask Layer | Top Layer | Dielectric1 | Bottom Layer | Bottom Solder Mask Layer | Bottom Paste Mask Layer | Bottom Silkscreen Layer | Type | TOP_SILK | TOP_PASTE_MASK | TOP_SOLDER_MASK | TOP | SUBSTRATE | BOTTOM | BOT_SOLDER_MASK | BOT_PASTE_MASK | BOT_SILK | Material | - | FR4 | Thickness(mm) | 0 | 0.01 | 0.035 | 1.51 | Permittivity | 3.3 | 4.5 | Loss Tangent | 0.02 | Board size: 40x48mm / Fixing holes: Pitch 30mm, Dia 2.75 mm | PASSMAN
Top Layer: PAZZ / 072025
Top Silkscreen Layer: WAKE | VDD | GND | VT | RX | TX | PASSMAN V1 082025
Drill Drawing Layer: Mark | A | Count | 2 | 4 | 6 | 8 | 16 | 87 | Size | 31.5x31.5mil(0.800x0.800mm) | 108.3mil(2.750mm) | 31.5mil(0.800mm) | 35.4mil(0.900mm) | 18.0mil(0.457mm) | 39.4x39.4mil(1.000x1.000mm) | 23.6x23.6mil(0.600x0.600mm) | 47.2x47.2mil(1.200x1.200mm) | 36.0x36.0mil(0.914x0.914mm) | 12.0mil(0.305mm) | Plated | PTH | NPTH | Shape | Round | Via/Pad | Pad | Via | Pad Shape | (Mixed) | Layer Pair | Top Layer-Bottom Layer
